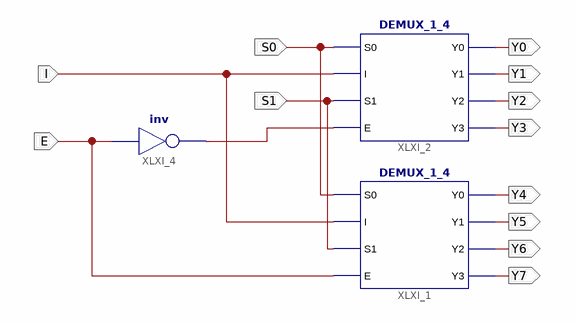
[diagram p0: schematic sheet 1]
// Xilinx ISE schematic DEMUX_1_8.sch (artix7) as structural Verilog: 3 symbols, 12 ports
module DEMUX_1_8 (
  input  S1,
  input  S0,
  input  E,
  input  I,
  output Y0,
  output Y1,
  output Y2,
  output Y3,
  output Y4,
  output Y5,
  output Y6,
  output Y7
);

  wire XLXN_11;

  DEMUX_1_4 XLXI_1 (.S0(S0), .I(I), .S1(S1), .E(E), .Y0(Y4), .Y1(Y5), .Y2(Y6), .Y3(Y7));
  DEMUX_1_4 XLXI_2 (.S0(S0), .I(I), .S1(S1), .E(XLXN_11), .Y0(Y0), .Y1(Y1), .Y2(Y2), .Y3(Y3));
  not XLXI_4 (XLXN_11, E);
endmodule
